# EAGLE schematic TEC-BVr2 (EAGLE 9.6.2)
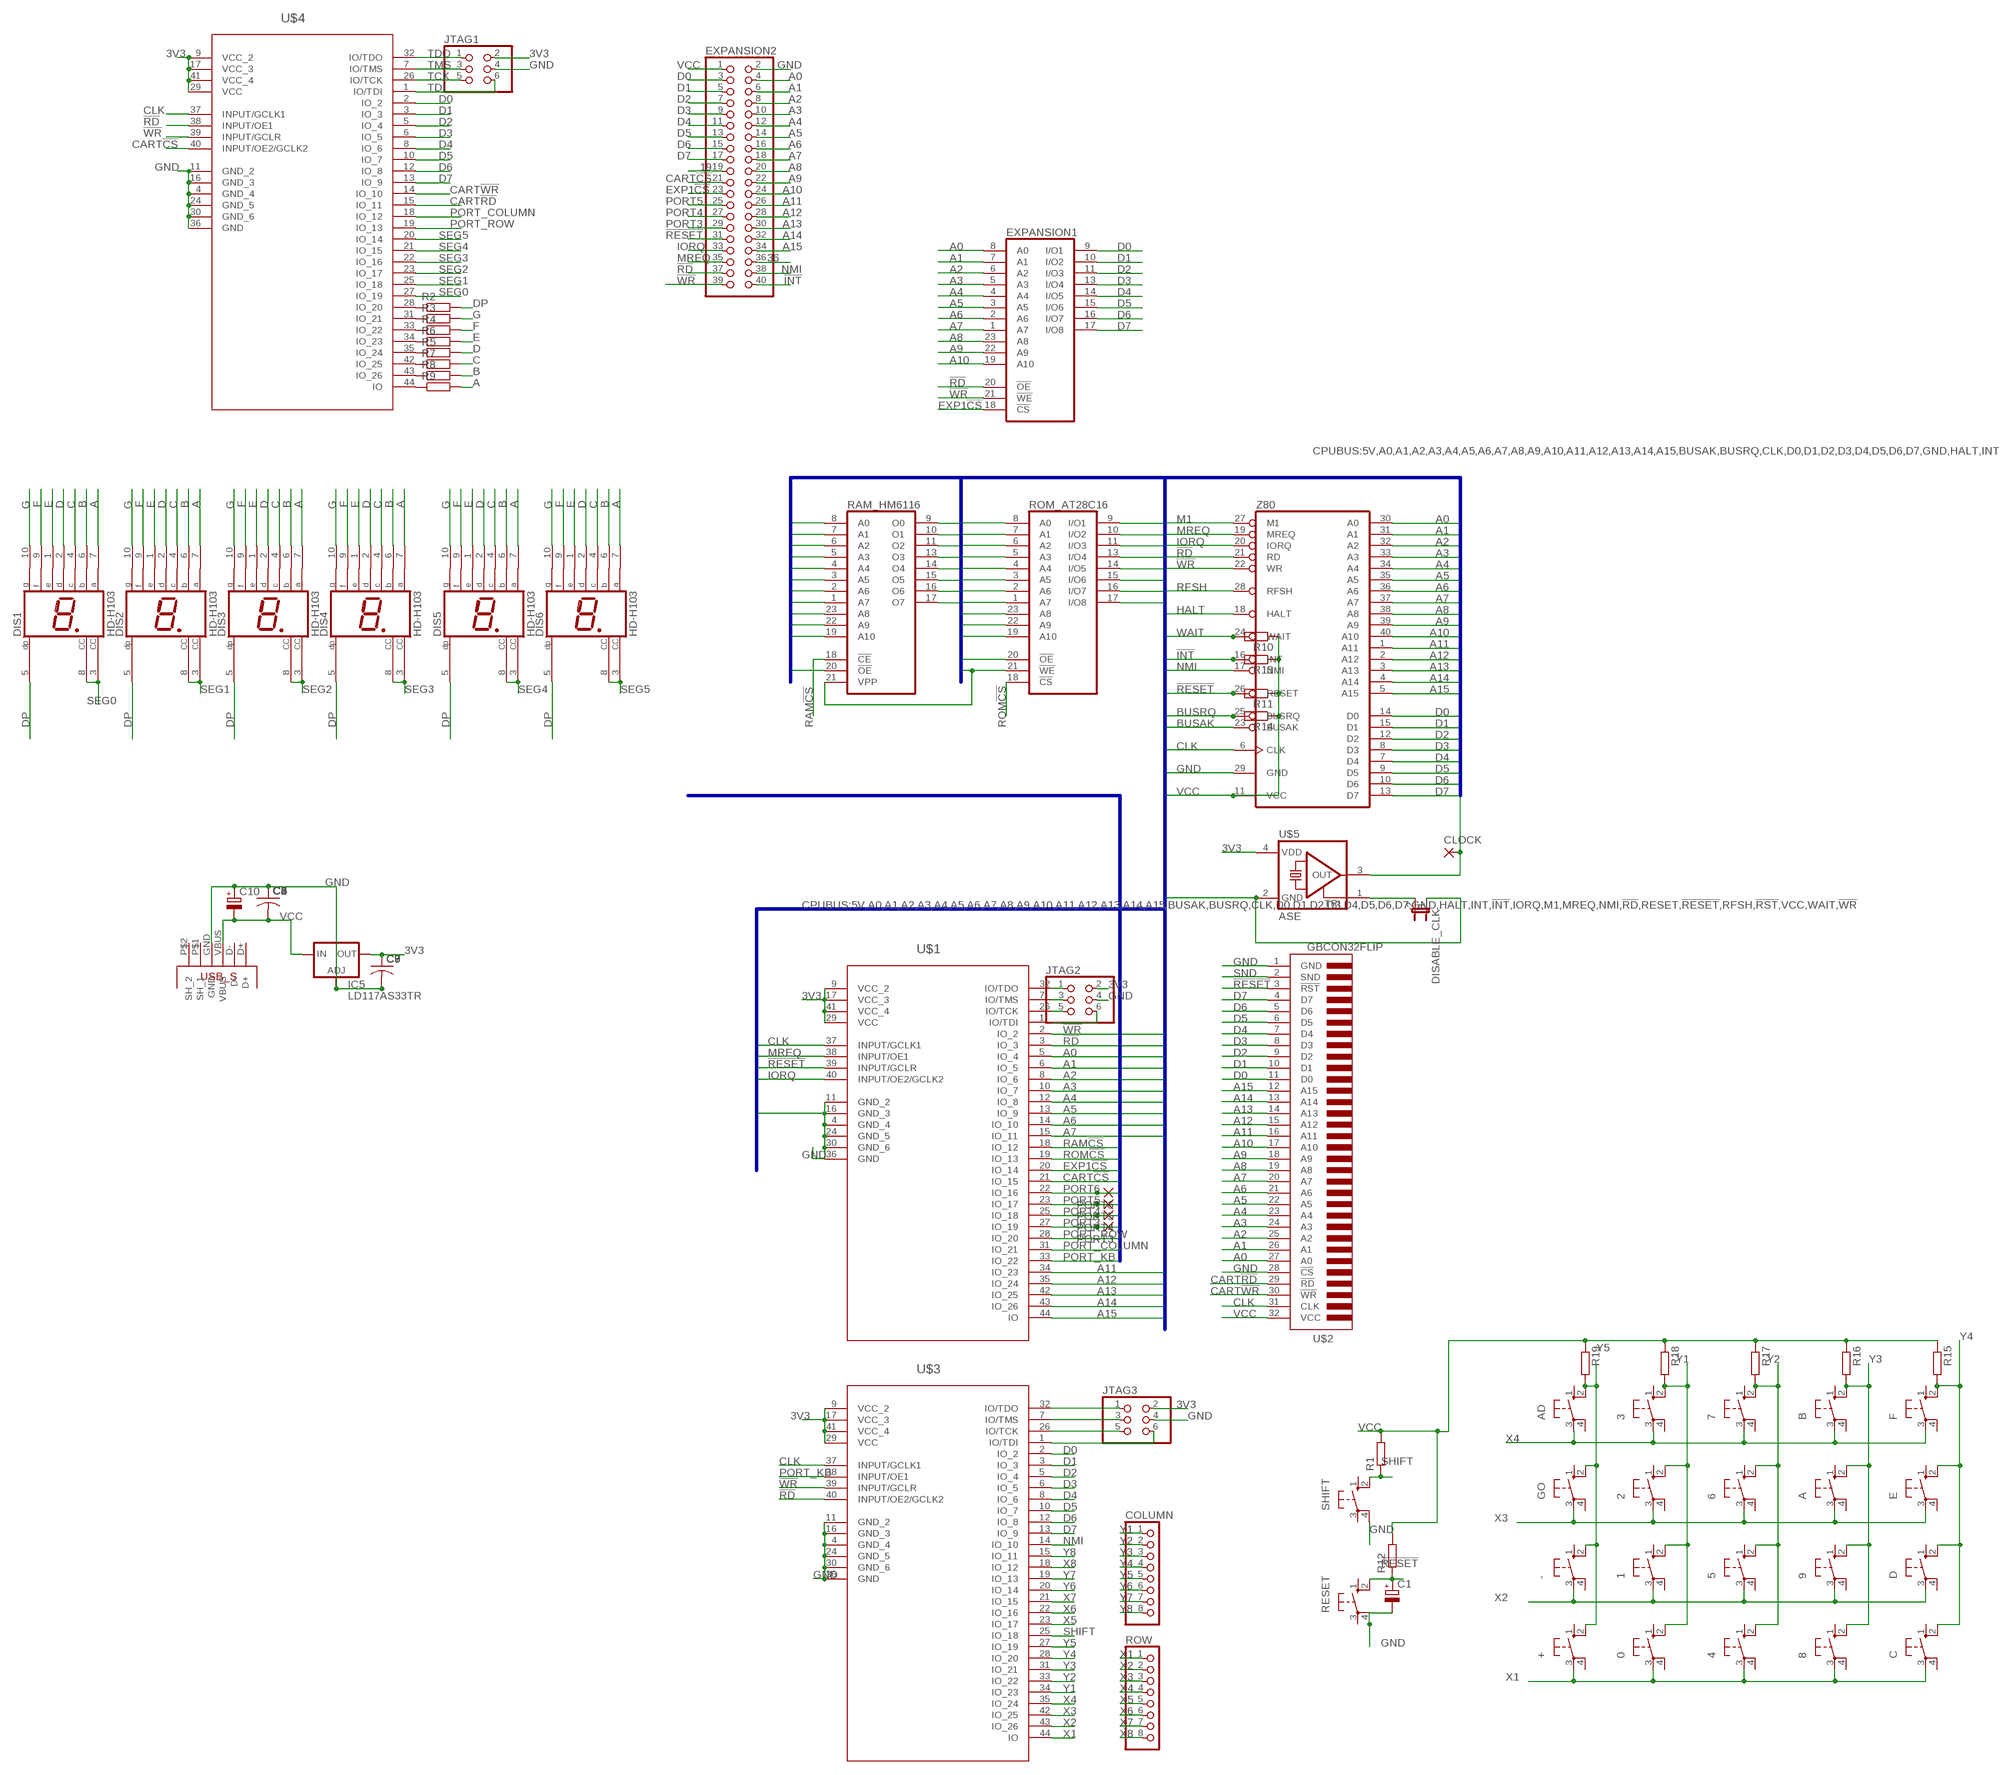
[diagram p0: schematic, sheet 1, part 1 of 2]
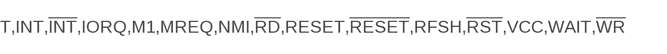
[diagram p1: schematic, sheet 1, part 2 of 2]

## Parts
0  10-XX  [B3F-10XX]
1  10-XX  [B3F-10XX]
2  10-XX  [B3F-10XX]
3  10-XX  [B3F-10XX]
4  10-XX  [B3F-10XX]
5  10-XX  [B3F-10XX]
6  10-XX  [B3F-10XX]
7  10-XX  [B3F-10XX]
8  10-XX  [B3F-10XX]
9  10-XX  [B3F-10XX]
+  10-XX  [B3F-10XX]
-  10-XX  [B3F-10XX]
A  10-XX  [B3F-10XX]
AD  10-XX  [B3F-10XX]
B  10-XX  [B3F-10XX]
C  10-XX  [B3F-10XX]
C1  CPOL-EUE2,5-6E  [E2,5-6E]
C2  C-US050-024X044  [C050-024X044]
C3  C-US050-024X044  [C050-024X044]
C4  C-US050-024X044  [C050-024X044]
C5  C-US050-024X044  [C050-024X044]
C6  C-US050-024X044  [C050-024X044]
C7  C-US050-024X044  [C050-024X044]
C8  C-US050-024X044  [C050-024X044]
C9  C-US050-024X044  [C050-024X044]
C10  CPOL-EUE2,5-6E  [E2,5-6E]
CLOCK  1,6/0,8  [1,6/0,8]
COLUMN  PINHD-1X8  [1X08]
D  10-XX  [B3F-10XX]
DIS1  HD-H103  [HDSP-M]
DIS2  HD-H103  [HDSP-M]
DIS3  HD-H103  [HDSP-M]
DIS4  HD-H103  [HDSP-M]
DIS5  HD-H103  [HDSP-M]
DIS6  HD-H103  [HDSP-M]
DISABLE_CLK  JP1E  [JP1]
E  10-XX  [B3F-10XX]
EXPANSION1  6116P  [DIL24-6]
EXPANSION2  PINHD-2X20  [2X20]
F  10-XX  [B3F-10XX]
GO  10-XX  [B3F-10XX]
IC5  LD117AS33TR  [SOT223]
JTAG1  PINHD-2X3  [2X03]
JTAG2  PINHD-2X3  [2X03]
JTAG3  PINHD-2X3  [2X03]
PORT3  1,6/0,8  [1,6/0,8]
PORT4  1,6/0,8  [1,6/0,8]
PORT5  1,6/0,8  [1,6/0,8]
PORT6  1,6/0,8  [1,6/0,8]
R1  R-EU_0207/12  [0207/12]
R2  R-EU_0207/12  [0207/12]
R3  R-EU_0207/12  [0207/12]
R4  R-EU_0207/12  [0207/12]
R5  R-EU_0207/12  [0207/12]
R6  R-EU_0207/12  [0207/12]
R7  R-EU_0207/12  [0207/12]
R8  R-EU_0207/12  [0207/12]
R9  R-EU_0207/12  [0207/12]
R10  R-EU_0207/12  [0207/12]
R11  R-EU_0207/12  [0207/12]
R12  R-EU_0207/12  [0207/12]
R13  R-EU_0207/12  [0207/12]
R14  R-EU_0207/12  [0207/12]
R15  R-EU_0204/7  [0204/7]
R16  R-EU_0204/7  [0204/7]
R17  R-EU_0204/7  [0204/7]
R18  R-EU_0204/7  [0204/7]
R19  R-EU_0204/7  [0204/7]
RAM_HM6116  2716  [DIL24]
RESET  10-XX  [B3F-10XX]
ROM_AT28C16  6116P  [DIL24-6]
ROW  PINHD-1X8  [1X08]
SHIFT  10-XX  [B3F-10XX]
U$1  Address Decoding  EPM3064ATC44-10N  [QFP80P1200X1200X120-44N]
U$2  GBCON32FLIP  [GB_CON32]
U$3  Keyboard Decoding  EPM3064ATC44-10N  [QFP80P1200X1200X120-44N]
U$4  Display Decoding  EPM3064ATC44-10N  [QFP80P1200X1200X120-44N]
U$5  ASE  [ASE]
U$6  USB  [USB_B_PTH]
Z80  Z80CPU  [DIL40]

## Nets
3V3: C7.1 C8.1 C9.1 IC5.4(OUT) JTAG1.2 JTAG2.2 JTAG3.2 U$1.9(VCC_2) U$1.17(VCC_3) U$1.29(VCC) U$1.41(VCC_4) U$3.9(VCC_2) U$3.17(VCC_3) U$3.29(VCC) U$3.41(VCC_4) U$4.9(VCC_2) U$4.17(VCC_3) U$4.29(VCC) U$4.41(VCC_4) U$5.4(VDD)
19: EXPANSION2.19
36: EXPANSION2.36
!INT: EXPANSION2.40 R13.2 Z80.16(INT)
!RD: EXPANSION1.20(!OE) EXPANSION2.37 RAM_HM6116.20(!OE) ROM_AT28C16.20(!OE) U$1.3(IO_3) U$3.40(INPUT/OE2/GCLK2) U$4.38(INPUT/OE1) Z80.21(RD)
!RESET: C1.+ EXPANSION2.31 R11.2 R12.1 RESET.2(S1) U$1.39(INPUT/GCLR) U$2.3(!RST) Z80.26(RESET)
!WR: EXPANSION1.21(!WE) EXPANSION2.39 RAM_HM6116.21(VPP) ROM_AT28C16.21(!WE) U$1.2(IO_2) U$3.39(INPUT/GCLR) U$4.39(INPUT/GCLR) Z80.22(WR)
A: DIS1.7(A) DIS2.7(A) DIS3.7(A) DIS4.7(A) DIS5.7(A) DIS6.7(A) R9.2
A0: EXPANSION1.8(A0) EXPANSION2.4 RAM_HM6116.8(A0) ROM_AT28C16.8(A0) U$1.5(IO_4) U$2.27(A0) Z80.30(A0)
A1: EXPANSION1.7(A1) EXPANSION2.6 RAM_HM6116.7(A1) ROM_AT28C16.7(A1) U$1.6(IO_5) U$2.26(A1) Z80.31(A1)
A2: EXPANSION1.6(A2) EXPANSION2.8 RAM_HM6116.6(A2) ROM_AT28C16.6(A2) U$1.8(IO_6) U$2.25(A2) Z80.32(A2)
A3: EXPANSION1.5(A3) EXPANSION2.10 RAM_HM6116.5(A3) ROM_AT28C16.5(A3) U$1.10(IO_7) U$2.24(A3) Z80.33(A3)
A4: EXPANSION1.4(A4) EXPANSION2.12 RAM_HM6116.4(A4) ROM_AT28C16.4(A4) U$1.12(IO_8) U$2.23(A4) Z80.34(A4)
A5: EXPANSION1.3(A5) EXPANSION2.14 RAM_HM6116.3(A5) ROM_AT28C16.3(A5) U$1.13(IO_9) U$2.22(A5) Z80.35(A5)
A6: EXPANSION1.2(A6) EXPANSION2.16 RAM_HM6116.2(A6) ROM_AT28C16.2(A6) U$1.14(IO_10) U$2.21(A6) Z80.36(A6)
A7: EXPANSION1.1(A7) EXPANSION2.18 RAM_HM6116.1(A7) ROM_AT28C16.1(A7) U$1.15(IO_11) U$2.20(A7) Z80.37(A7)
A8: EXPANSION1.23(A8) EXPANSION2.20 RAM_HM6116.23(A8) ROM_AT28C16.23(A8) U$2.19(A8) Z80.38(A8)
A9: EXPANSION1.22(A9) EXPANSION2.22 RAM_HM6116.22(A9) ROM_AT28C16.22(A9) U$2.18(A9) Z80.39(A9)
A10: EXPANSION1.19(A10) EXPANSION2.24 RAM_HM6116.19(A10) ROM_AT28C16.19(A10) U$2.17(A10) Z80.40(A10)
A11: EXPANSION2.26 U$1.34(IO_23) U$2.16(A11) Z80.1(A11)
A12: EXPANSION2.28 U$1.35(IO_24) U$2.15(A12) Z80.2(A12)
A13: EXPANSION2.30 U$1.42(IO_25) U$2.14(A13) Z80.3(A13)
A14: EXPANSION2.32 U$1.43(IO_26) U$2.13(A14) Z80.4(A14)
A15: EXPANSION2.34 U$1.44(IO) U$2.12(A15) Z80.5(A15)
B: DIS1.6(B) DIS2.6(B) DIS3.6(B) DIS4.6(B) DIS5.6(B) DIS6.6(B) R8.2
BUSAK: Z80.23(BUSAK)
BUSRQ: R14.2 Z80.25(BUSRQ)
C: DIS1.4(C) DIS2.4(C) DIS3.4(C) DIS4.4(C) DIS5.4(C) DIS6.4(C) R7.2
CART!CS: EXPANSION2.21 U$1.21(IO_15) U$4.40(INPUT/OE2/GCLK2)
CART!RD: U$2.29(!RD) U$4.15(IO_11)
CART!WR: U$2.30(!WR) U$4.14(IO_10)
CLK: CLOCK.1(P) U$1.37(INPUT/GCLK1) U$2.31(CLK) U$3.37(INPUT/GCLK1) U$4.37(INPUT/GCLK1) U$5.3(OUT) Z80.6(CLK)
D: DIS1.2(D) DIS2.2(D) DIS3.2(D) DIS4.2(D) DIS5.2(D) DIS6.2(D) R5.2
D0: EXPANSION1.9(I/O1) EXPANSION2.3 RAM_HM6116.9(O0) ROM_AT28C16.9(I/O1) U$2.11(D0) U$3.2(IO_2) U$4.2(IO_2) Z80.14(D0)
D1: EXPANSION1.10(I/O2) EXPANSION2.5 RAM_HM6116.10(O1) ROM_AT28C16.10(I/O2) U$2.10(D1) U$3.3(IO_3) U$4.3(IO_3) Z80.15(D1)
D2: EXPANSION1.11(I/O3) EXPANSION2.7 RAM_HM6116.11(O2) ROM_AT28C16.11(I/O3) U$2.9(D2) U$3.5(IO_4) U$4.5(IO_4) Z80.12(D2)
D3: EXPANSION1.13(I/O4) EXPANSION2.9 RAM_HM6116.13(O3) ROM_AT28C16.13(I/O4) U$2.8(D3) U$3.6(IO_5) U$4.6(IO_5) Z80.8(D3)
D4: EXPANSION1.14(I/O5) EXPANSION2.11 RAM_HM6116.14(O4) ROM_AT28C16.14(I/O5) U$2.7(D4) U$3.8(IO_6) U$4.8(IO_6) Z80.7(D4)
D5: EXPANSION1.15(I/O6) EXPANSION2.13 RAM_HM6116.15(O5) ROM_AT28C16.15(I/O6) U$2.6(D5) U$3.10(IO_7) U$4.10(IO_7) Z80.9(D5)
D6: EXPANSION1.16(I/O7) EXPANSION2.15 RAM_HM6116.16(O6) ROM_AT28C16.16(I/O7) U$2.5(D6) U$3.12(IO_8) U$4.12(IO_8) Z80.10(D6)
D7: EXPANSION1.17(I/O8) EXPANSION2.17 RAM_HM6116.17(O7) ROM_AT28C16.17(I/O8) U$2.4(D7) U$3.13(IO_9) U$4.13(IO_9) Z80.13(D7)
DP: DIS1.5(DP) DIS2.5(DP) DIS3.5(DP) DIS4.5(DP) DIS5.5(DP) DIS6.5(DP) R2.2
E: DIS1.1(E) DIS2.1(E) DIS3.1(E) DIS4.1(E) DIS5.1(E) DIS6.1(E) R6.2
EXP1!CS: EXPANSION1.18(!CS) EXPANSION2.23 U$1.20(IO_14)
F: DIS1.9(F) DIS2.9(F) DIS3.9(F) DIS4.9(F) DIS5.9(F) DIS6.9(F) R4.2
G: DIS1.10(G) DIS2.10(G) DIS3.10(G) DIS4.10(G) DIS5.10(G) DIS6.10(G) R3.2
GND: C1.- C2.1 C3.1 C4.1 C5.1 C6.1 C7.2 C8.2 C9.2 C10.+ DISABLE_CLK.1 EXPANSION2.2 IC5.1(ADJ) JTAG1.4 JTAG2.4 JTAG3.4 RESET.4(P1) SHIFT.4(P1) U$1.4(GND_4) U$1.11(GND_2) U$1.16(GND_3) U$1.24(GND_5) U$1.30(GND_6) U$1.36(GND) U$2.1(GND) U$2.28(!CS) U$3.4(GND_4) U$3.11(GND_2) U$3.16(GND_3) U$3.24(GND_5) U$3.30(GND_6) U$3.36(GND) U$4.4(GND_4) U$4.11(GND_2) U$4.16(GND_3) U$4.24(GND_5) U$4.30(GND_6) U$4.36(GND) U$5.2(GND) U$6.GND Z80.29(GND)
HALT: Z80.18(HALT)
IORQ: EXPANSION2.33 U$1.40(INPUT/OE2/GCLK2) Z80.20(IORQ)
M1: Z80.27(M1)
MREQ: EXPANSION2.35 U$1.38(INPUT/OE1) Z80.19(MREQ)
N$1: R2.1 U$4.28(IO_20)
N$2: R3.1 U$4.31(IO_21)
N$3: R4.1 U$4.33(IO_22)
N$4: R5.1 U$4.35(IO_24)
N$5: JTAG3.1 U$3.32(IO/TDO)
N$6: DISABLE_CLK.2 U$5.1(TRI)
N$7: JTAG3.3 U$3.7(IO/TMS)
N$8: R6.1 U$4.34(IO_23)
N$9: R7.1 U$4.42(IO_25)
N$10: R8.1 U$4.43(IO_26)
N$11: R9.1 U$4.44(IO)
N$12: JTAG3.5 U$3.26(IO/TCK)
N$13: JTAG3.6 U$3.1(IO/TDI)
N$14: JTAG2.1 U$1.32(IO/TDO)
N$15: JTAG2.3 U$1.7(IO/TMS)
N$16: JTAG2.5 U$1.26(IO/TCK)
N$23: JTAG2.6 U$1.1(IO/TDI)
NMI: EXPANSION2.38 U$3.14(IO_10) Z80.17(NMI)
PORT3: EXPANSION2.29 PORT3.1(P) U$1.27(IO_19)
PORT4: EXPANSION2.27 PORT4.1(P) U$1.25(IO_18)
PORT5: EXPANSION2.25 PORT5.1(P) U$1.23(IO_17)
PORT6: PORT6.1(P) U$1.22(IO_16)
PORT_COLUMN: U$1.31(IO_21) U$4.18(IO_12)
PORT_KB: U$1.33(IO_22) U$3.38(INPUT/OE1)
PORT_ROW: U$1.28(IO_20) U$4.19(IO_13)
RAM!CS: RAM_HM6116.18(!CE) U$1.18(IO_12)
RFSH: Z80.28(RFSH)
ROM!CS: ROM_AT28C16.18(!CS) U$1.19(IO_13)
SEG0: DIS1.3(CC) DIS1.8(CC) U$4.27(IO_19)
SEG1: DIS2.3(CC) DIS2.8(CC) U$4.25(IO_18)
SEG2: DIS3.3(CC) DIS3.8(CC) U$4.23(IO_17)
SEG3: DIS4.3(CC) DIS4.8(CC) U$4.22(IO_16)
SEG4: DIS5.3(CC) DIS5.8(CC) U$4.21(IO_15)
SEG5: DIS6.3(CC) DIS6.8(CC) U$4.20(IO_14)
SHIFT: R1.1 SHIFT.2(S1) U$3.25(IO_18)
SND: U$2.2(SND)
TCK: JTAG1.5 U$4.26(IO/TCK)
TDI: JTAG1.6 U$4.1(IO/TDI)
TDO: JTAG1.1 U$4.32(IO/TDO)
TMS: JTAG1.3 U$4.7(IO/TMS)
VCC: C2.2 C3.2 C4.2 C5.2 C6.2 C10.- EXPANSION2.1 IC5.3(IN) R1.2 R10.1 R11.1 R12.2 R13.1 R14.1 R15.1 R16.1 R17.1 R18.1 R19.1 U$2.32(VCC) U$6.VBUS Z80.11(VCC)
WAIT: R10.2 Z80.24(WAIT)
X1: 0.3(P) 4.3(P) 8.3(P) +.3(P) C.3(P) ROW.1 U$3.44(IO)
X2: 1.3(P) 5.3(P) 9.3(P) -.3(P) D.3(P) ROW.2 U$3.43(IO_26)
X3: 2.3(P) 6.3(P) A.3(P) E.3(P) GO.3(P) ROW.3 U$3.42(IO_25)
X4: 3.3(P) 7.3(P) AD.3(P) B.3(P) F.3(P) ROW.4 U$3.35(IO_24)
X5: ROW.5 U$3.23(IO_17)
X6: ROW.6 U$3.22(IO_16)
X7: ROW.7 U$3.21(IO_15)
X8: ROW.8 U$3.18(IO_12)
Y1: 0.2(S1) 1.2(S1) 2.2(S1) 3.2(S1) COLUMN.1 R18.2 U$3.34(IO_23)
Y2: 4.2(S1) 5.2(S1) 6.2(S1) 7.2(S1) COLUMN.2 R17.2 U$3.33(IO_22)
Y3: 8.2(S1) 9.2(S1) A.2(S1) B.2(S1) COLUMN.3 R16.2 U$3.31(IO_21)
Y4: C.2(S1) COLUMN.4 D.2(S1) E.2(S1) F.2(S1) R15.2 U$3.28(IO_20)
Y5: +.2(S1) -.2(S1) AD.2(S1) COLUMN.5 GO.2(S1) R19.2 U$3.27(IO_19)
Y6: COLUMN.6 U$3.20(IO_14)
Y7: COLUMN.7 U$3.19(IO_13)
Y8: COLUMN.8 U$3.15(IO_11)
Unconnected: 0.1(S) 0.4(P1) 1.1(S) 1.4(P1) 2.1(S) 2.4(P1) 3.1(S) 3.4(P1) 4.1(S) 4.4(P1) 5.1(S) 5.4(P1) 6.1(S) 6.4(P1) 7.1(S) 7.4(P1) 8.1(S) 8.4(P1) 9.1(S) 9.4(P1) +.1(S) +.4(P1) -.1(S) -.4(P1) A.1(S) A.4(P1) AD.1(S) AD.4(P1) B.1(S) B.4(P1) C.1(S) C.4(P1) D.1(S) D.4(P1) E.1(S) E.4(P1) F.1(S) F.4(P1) GO.1(S) GO.4(P1) RESET.1(S) RESET.3(P) SHIFT.1(S) SHIFT.3(P) U$6.D+ U$6.D- U$6.P$1(SH_1) U$6.P$2(SH_2)

## Buses
CPUBUS:5V,A0,A1,A2,A3,A4,A5,A6,A7,A8,A9,A10,A11,A12,A13,A14,A15,BUSAK,BUSRQ,CLK,D0,D1,D2,D3,D4,D5,D6,D7,GND,HALT,INT,!INT,IORQ,M1,MREQ,NMI,!RD,RESET,!RESET,RFSH,!RST,VCC,WAIT,!WR
IO_BUS:CART!CS,EXP1!CS,PORT0,PORT1,PORT2,PORT3,PORT4,PORT5,PORT6,ROM!CS

## Power pins joined to a net without a drawn wire
GND: EXPANSION1.12(GND) RAM_HM6116.12(GND) ROM_AT28C16.12(GND)
VCC: EXPANSION1.24(VCC) RAM_HM6116.24(VCC) ROM_AT28C16.24(VCC)

## Library data of the parts
0 1-9 + - A AD B C D E F GO RESET SHIFT = switch-omron:10-XX: OMRON SWITCH; MPN: B3F-1000; OC_FARNELL: 176432; OC_NEWARK: 36M3542
C1 C10 = rcl:CPOL-EU: POLARIZED CAPACITOR, European symbol; SPICEPREFIX: C
C2-C9 = rcl:C-US: CAPACITOR, American symbol; SPICEPREFIX: C
CLOCK PORT3-PORT6 = wirepad:1,6/0,8: THROUGH-HOLE PAD
COLUMN ROW = pinhead:PINHD-1X8: PIN HEADER
DIS1-DIS6 = display-hp:HD-H103: LED DISPLAY 1-character 7 segment, decimal point right; OC_FARNELL: unknown; OC_NEWARK: unknown
DISABLE_CLK = jumper:JP1E: JUMPER
EXPANSION1 ROM_AT28C16 = memory-idt:6116P: MEMORY; OC_FARNELL: unknown; OC_NEWARK: unknown
EXPANSION2 = pinhead:PINHD-2X20: PIN HEADER
IC5 = v-reg:LD117A?*: Low drop fixed and adjustable positive voltage regulators 1 A Source: http://www.st.com/stonline/products/literature/ds/7194/ld1117axx.pdf
JTAG1-JTAG3 = pinhead:PINHD-2X3: PIN HEADER
R1-R19 = rcl:R-EU_: RESISTOR, European symbol; SPICEPREFIX: R
RAM_HM6116 = memory:2716: MEMORY
U$1 U$3 U$4 = Altera-3064_tpfq:EPM3064ATC44-10N: Programmable Logic Device Family; MPN: EPM3064ATC44-10N; OC_FARNELL: 1549417; OC_NEWARK: 51R0505; PACKAGE: 44-TQFP; SUPPLIER: Altera
U$2 = GAMEBOY:GBCON32FLIP
U$5 = crystal:ASE: 3.3Vdc CMOS SMD CRYSTAL CLOCK OSCILLATOR SOurce: www.abracon.com; OC_FARNELL: unknown; OC_NEWARK: unknown
U$6 = NBitWonder:USB
Z80 = zilog:Z80CPU: Z80 FAMILY DEVICE